# Altium schematic sheet Connector.SchDoc
size A4; SheetNumber: 2; SheetTotal: 2
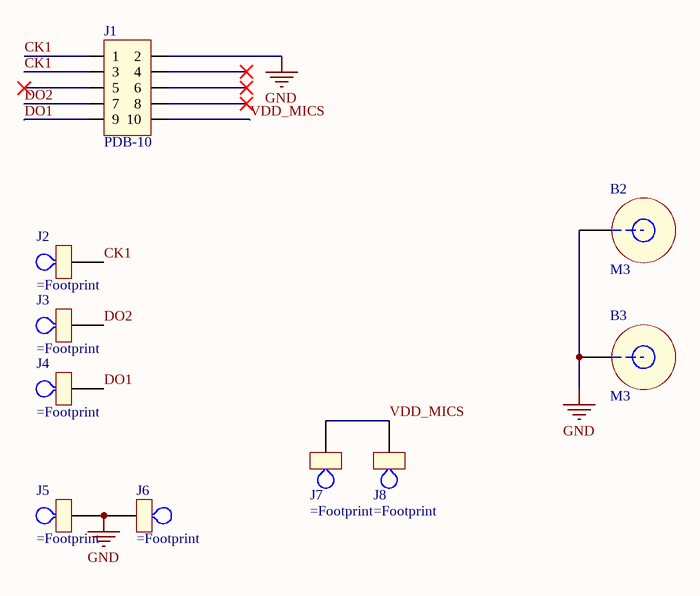
[diagram p0: Connector.SchDoc]

## Parts
B2  M3  [M3_Plated_Hole_NO_3D]  (no BOM)
B3  M3  [M3_Plated_Hole_NO_3D]  (no BOM)
J1  PDB-10  [PDB-10]
J2  (no value)  [5001]
J3  (no value)  [5001]
J4  (no value)  [5001]
J5  (no value)  [5001]
J6  (no value)  [5001]
J7  (no value)  [5001]
J8  (no value)  [5001]

## Nets
GND: B2.1 B3.1 J1.2 J5.1 J6.1
CK1: J1.1 J1.3 J2.1
DO1: J1.9 J4.1
DO2: J1.7 J3.1
VDD_MICS: J1.10 J7.1 J8.1

Not connected (* = marked no-connect by the designer): J1 4* 5* 6* 8*

## Library data of the parts
B2 B3 = M3: Machine Screw, M3
J2-J8 = Test_Point